# Altium project PCB_Project_Main.PrjPcb
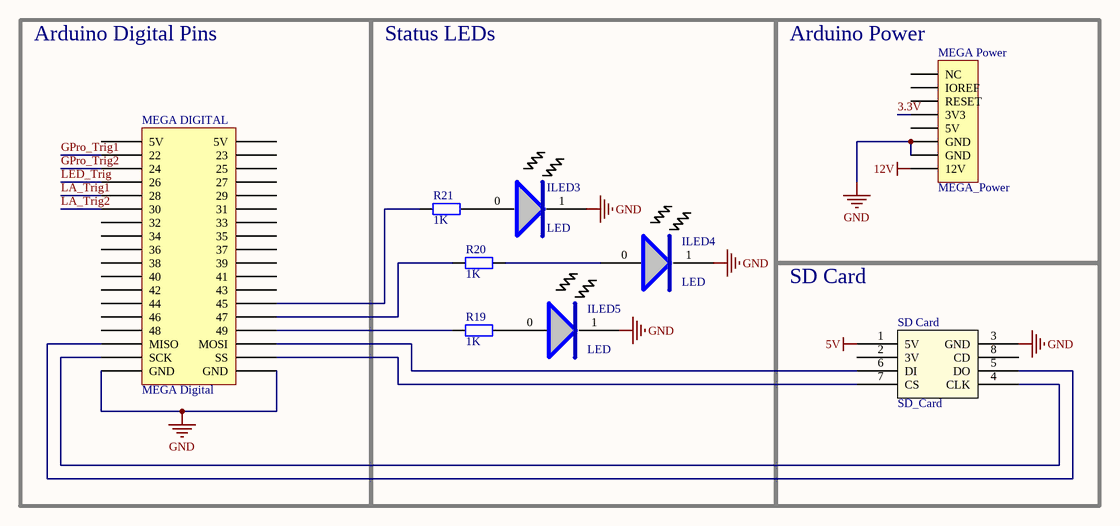
[diagram p0: ArduinoPWR-DIG_SDCard.SchDoc]
6 sheets, 107 parts. Net scope: global (net labels, ports and power ports of the same name join across sheets).
Board files: ArduinoMainBoard.PcbDoc, mainPCB_V2.PcbDoc
Sheets:
  ArduinoPWR-DIG_SDCard.SchDoc
  Analog_Input.SchDoc
  Telemetry_AnalogSensors_PTC08_Shifter.SchDoc
  Power_TimerEvents.SchDoc
  GoPro_Actuator_LED.SchDoc
  temp_presX3.SchDoc

## Sheet ArduinoPWR-DIG_SDCard.SchDoc
size A

### Parts
ILED3  LED  [LED]
ILED4  LED  [LED]
ILED5  LED  [LED]
MEGA_DIGITAL  MEGA Digital  [HDR2X18]
MEGA_Power  MEGA_Power  [HDR1X8]
R19  value 1K  [AXIAL-0.4]  (hidden comment: Res2)
R20  value 1K  [AXIAL-0.4]  (hidden comment: Res2)
R21  value 1K  [AXIAL-0.4]  (hidden comment: Res2)
SD_Card  SD_Card  [HDR1X8]

### Blocks framed on the sheet
Arduino Digital Pins: MEGA_DIGITAL
Status LEDs: ILED3-ILED5 R19-R21
Arduino Power: MEGA_Power
SD Card: SD_Card

### Nets
5V: SD_Card.1(5V)
12V: MEGA_Power.8(12V)
GND: ILED3.1 ILED4.1 ILED5.1 MEGA_DIGITAL.35(GND) MEGA_DIGITAL.36(GND) MEGA_Power.6(GND) MEGA_Power.7(GND) SD_Card.3(GND)
3.3V: MEGA_Power.4(3V3)
GPro_Trig1: MEGA_DIGITAL.5(22)
GPro_Trig2: MEGA_DIGITAL.25(24)
LA_Trig1: MEGA_DIGITAL.9(28)
LA_Trig2: MEGA_DIGITAL.11(30)
LED_Trig: MEGA_DIGITAL.7(26)
NetILED3_0: ILED3.0 R21.1
NetILED4_0: ILED4.0 R20.1
NetILED5_0: ILED5.0 R19.1
NetMEGA_DIGITAL_26: MEGA_DIGITAL.26(45) R21.2
NetMEGA_DIGITAL_28: MEGA_DIGITAL.28(47) R20.2
NetMEGA_DIGITAL_30: MEGA_DIGITAL.30(49) R19.2
NetMEGA_DIGITAL_31: MEGA_DIGITAL.31(MISO) SD_Card.5(DO)
NetMEGA_DIGITAL_32: MEGA_DIGITAL.32(MOSI) SD_Card.6(DI)
NetMEGA_DIGITAL_33: MEGA_DIGITAL.33(SCK) SD_Card.4(CLK)
NetMEGA_DIGITAL_34: MEGA_DIGITAL.34(SS) SD_Card.7(CS)

Not connected (* = marked no-connect by the designer): MEGA_DIGITAL 1(5V) 2(5V) 3(44) 4(23) 6(25) 8(27) 10(29) 12(31) 13(32) 14(33) 15(34) 16(35) 17(36) 18(37) 19(38) 20(39) 21(40) 22(41) 23(42) 24(43) 27(46) 29(48); MEGA_Power 1(NC) 2(IOREF) 3(RESET) 5(5V); SD_Card 2(3V) 8(CD)

### Notes on the sheet
- Title
- Size:
- Date:
- A
- Number:
- Time:
- Revision:
- Sheet
- of
- File:

### Library data of the parts
MEGA_DIGITAL SD_Card = Component_1
MEGA_Power = Header 8: Header, 8-Pin; LatestRevisionDate: 17-Jul-2002; LatestRevisionNote: Re-released for DXP Platform.; Publisher: Altium Limited
R19-R21 = Res2: Resistor; Published: 8-Jun-2000; LatestRevisionDate: 17-Jul-2002; LatestRevisionNote: Re-released for DXP Platform.; PackageReference: AXIAL-0.4; Publisher: Altium Limited; PackageDescription: Axial Device, Thru-Hole; 2 Leads; 0.4 in Pin Spacing

## Sheet Analog_Input.SchDoc
size A
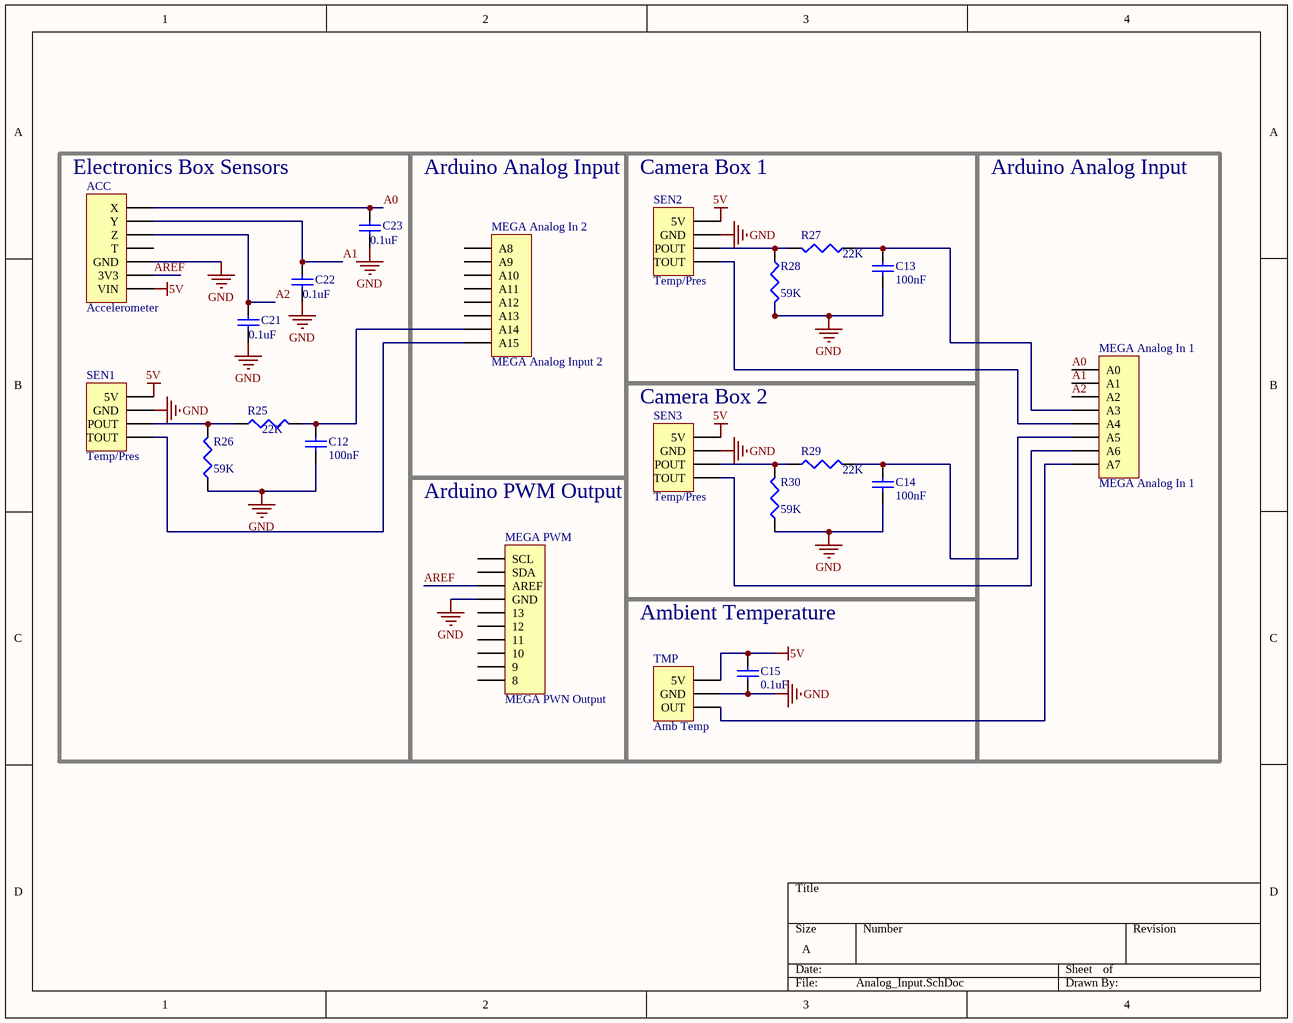
[diagram p1: Analog_Input.SchDoc]

### Parts
ACC  Accelerometer  [HDR1X7]
C12  100nF  [C1206]
C13  100nF  [C1206]
C14  100nF  [C1206]
C15  0.1uF  [C1206]
C21  0.1uF  [C1206]
C22  0.1uF  [C1206]
C23  0.1uF  [C1206]
MEGA_Analog_In_1  MEGA Analog In 1  [HDR1X8]
MEGA_Analog_In_2  MEGA Analog Input 2  [HDR1X8]
MEGA_PWM  MEGA PWN Output  [HDR1X10]
R25  22K  [J1-0603]
R26  59K  [J1-0603]
R27  22K  [J1-0603]
R28  59K  [J1-0603]
R29  22K  [J1-0603]
R30  59K  [J1-0603]
SEN1  Temp/Pres  [HDR1X4]
SEN2  Temp/Pres  [HDR1X4]
SEN3  Temp/Pres  [HDR1X4]
TMP  Amb Temp  [HDR1X3]

### Blocks framed on the sheet
Electronics Box Sensors: ACC C12 C21-C23 R25 R26 SEN1
Arduino Analog Input: MEGA_Analog_In_2
Camera Box 1: C13 R27 R28 SEN2
Arduino Analog Input: MEGA_Analog_In_1
Camera Box 2: C14 R29 R30 SEN3
Arduino PWM Output: MEGA_PWM
Ambient Temperature: C15 TMP

### Nets
5V: ACC.1(VIN) C15.1 SEN1.1(5V) SEN2.1(5V) SEN3.1(5V) TMP.1(5V)
GND: ACC.3(GND) C12.1 C13.1 C14.1 C15.2 C21.1 C22.1 C23.1 MEGA_PWM.4(GND) R26.1 R28.2 R30.1 SEN1.2(GND) SEN2.2(GND) SEN3.2(GND) TMP.2(GND)
A0: ACC.7(X) C23.2 MEGA_Analog_In_1.1(A0)
A1: ACC.6(Y) C22.2 MEGA_Analog_In_1.2(A1)
A2: ACC.5(Z) C21.2 MEGA_Analog_In_1.3(A2)
AREF: ACC.2(3V3) MEGA_PWM.3(AREF)
NetC12_2: C12.2 MEGA_Analog_In_2.7(A14) R25.2
NetC13_2: C13.2 MEGA_Analog_In_1.4(A3) R27.1
NetC14_2: C14.2 MEGA_Analog_In_1.6(A5) R29.2
NetMEGA_Analog_In_1_5: MEGA_Analog_In_1.5(A4) SEN2.4(TOUT)
NetMEGA_Analog_In_1_7: MEGA_Analog_In_1.7(A6) SEN3.4(TOUT)
NetMEGA_Analog_In_1_8: MEGA_Analog_In_1.8(A7) TMP.3(OUT)
NetMEGA_Analog_In_2_8: MEGA_Analog_In_2.8(A15) SEN1.4(TOUT)
NetR25_1: R25.1 R26.2 SEN1.3(POUT)
NetR27_2: R27.2 R28.1 SEN2.3(POUT)
NetR29_1: R29.1 R30.2 SEN3.3(POUT)

Not connected (* = marked no-connect by the designer): ACC 4(T); MEGA_Analog_In_2 1(A8) 2(A9) 3(A10) 4(A11) 5(A12) 6(A13); MEGA_PWM 1(SCL) 2(SDA) 5(13) 6(12) 7(11) 8(10) 9 10(8)

### Library data of the parts
ACC = Header 7: Header, 7-Pin; LatestRevisionDate: 17-Jul-2002; LatestRevisionNote: Re-released for DXP Platform.; Publisher: Altium Limited
C12-C15 C21-C23 = Cap Semi: Capacitor (Semiconductor SIM Model); Published: 8-Jun-2000; LatestRevisionDate: 29-May-2009; LatestRevisionNote: IPC-7351 Footprint Added.; PackageReference: C1206; Publisher: Altium Limited; PackageDescription: Chip Capacitor
  C12-C14: Value: 100nF
  C15 C21-C23: Value: 0.1uF
MEGA_Analog_In_1 MEGA_Analog_In_2 = Header 8: Header, 8-Pin; LatestRevisionDate: 17-Jul-2002; LatestRevisionNote: Re-released for DXP Platform.; Publisher: Altium Limited
MEGA_PWM = Header 10: Header, 10-Pin; LatestRevisionDate: 17-Jul-2002; LatestRevisionNote: Re-released for DXP Platform.; Publisher: Altium Limited
R25-R30 = Res3: Resistor; Published: 8-Jun-2000; LatestRevisionDate: 29-May-2009; LatestRevisionNote: IPC-7351 Footprint Added.; PackageReference: J1-0603; Publisher: Altium Limited; PackageDescription: Chip Resistor
  R25 R27 R29: Value: 22K
  R26 R28 R30: Value: 59K
SEN1-SEN3 = Header 4: Header, 4-Pin; LatestRevisionDate: 17-Jul-2002; LatestRevisionNote: Re-released for DXP Platform.; Publisher: Altium Limited
TMP = Header 3: Header, 3-Pin; LatestRevisionDate: 17-Jul-2002; LatestRevisionNote: Re-released for DXP Platform.; Publisher: Altium Limited

## Sheet Telemetry_AnalogSensors_PTC08_Shifter.SchDoc
size A
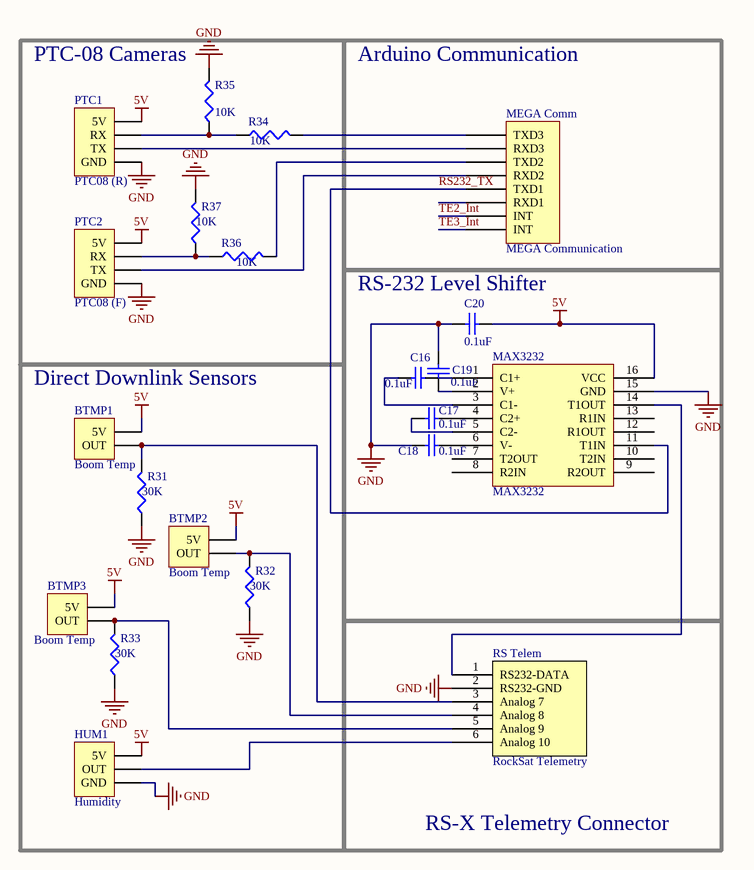
[diagram p2: Telemetry_AnalogSensors_PTC08_Shifter.SchDoc]

### Parts
BTMP1  Boom Temp  [HDR1X2]
BTMP2  Boom Temp  [HDR1X2]
BTMP3  Boom Temp  [HDR1X2]
C16  0.1uF  [C1206]
C17  0.1uF  [C1206]
C18  0.1uF  [C1206]
C19  0.1uF  [C1206]
C20  0.1uF  [C1206]
HUM1  Humidity  [HDR1X3]
MAX3232  MAX3232  [rs232]
MEGA_Comm  MEGA Communication  [HDR1X8]
PTC1  PTC08 (R)  [HDR1X4]
PTC2  PTC08 (F)  [HDR1X4]
R31  30K  [J1-0603]
R32  30K  [J1-0603]
R33  30K  [J1-0603]
R34  10K  [J1-0603]
R35  10K  [J1-0603]
R36  10K  [J1-0603]
R37  10K  [J1-0603]
RS_Telem  RockSat Telemetry  [HDR1X6]

### Blocks framed on the sheet
PTC-08 Cameras: PTC1 PTC2 R34-R37
Arduino Communication: MEGA_Comm
RS-232 Level Shifter: C16-C20 MAX3232
Direct Downlink Sensors: BTMP1-BTMP3 HUM1 R31-R33
RS-X Telemetry Connector: RS_Telem

### Nets
5V: BTMP1.1(5V) BTMP2.1(5V) BTMP3.1(5V) C20.1 HUM1.3(5V) MAX3232.16(VCC) PTC1.1(5V) PTC2.1(5V)
GND: C18.1 C19.2 C20.2 HUM1.1(GND) MAX3232.15(GND) PTC1.4(GND) PTC2.4(GND) R31.1 R32.1 R33.1 R35.2 R37.2 RS_Telem.2(RS232-GND)
RS232_TX: MAX3232.11(T1IN) MEGA_Comm.5(TXD1)
TE2_Int: MEGA_Comm.7(INT)
TE3_Int: MEGA_Comm.8(INT)
NetBTMP1_2: BTMP1.2(OUT) R31.2 RS_Telem.3(Analog_7)
NetBTMP2_2: BTMP2.2(OUT) R32.2 RS_Telem.4(Analog_8)
NetBTMP3_2: BTMP3.2(OUT) R33.2 RS_Telem.5(Analog_9)
NetC16_1: C16.1 MAX3232.1(C1+)
NetC16_2: C16.2 MAX3232.3(C1-)
NetC17_1: C17.1 MAX3232.4(C2+)
NetC17_2: C17.2 MAX3232.5(C2-)
NetC18_2: C18.2 MAX3232.6(V-)
NetC19_1: C19.1 MAX3232.2(V+)
NetHUM1_2: HUM1.2(OUT) RS_Telem.6(Analog_10)
NetMAX3232_14: MAX3232.14(T1OUT) RS_Telem.1(RS232-DATA)
NetMEGA_Comm_1: MEGA_Comm.1(TXD3) R34.2
NetMEGA_Comm_2: MEGA_Comm.2(RXD3) PTC1.3(TX)
NetMEGA_Comm_3: MEGA_Comm.3(TXD2) R36.2
NetMEGA_Comm_4: MEGA_Comm.4(RXD2) PTC2.3(TX)
NetPTC1_2: PTC1.2(RX) R34.1 R35.1
NetPTC2_2: PTC2.2(RX) R36.1 R37.1

Not connected (* = marked no-connect by the designer): MAX3232 7(T2OUT) 8(R2IN) 9(R2OUT) 10(T2IN) 12(R1OUT) 13(R1IN); MEGA_Comm 6(RXD1)

### Library data of the parts
BTMP1-BTMP3 = Header 2: Header, 2-Pin; LatestRevisionDate: 17-Jul-2002; LatestRevisionNote: Re-released for DXP Platform.; Publisher: Altium Limited
C16-C20 = Cap Semi: Capacitor (Semiconductor SIM Model); Published: 8-Jun-2000; LatestRevisionDate: 29-May-2009; LatestRevisionNote: IPC-7351 Footprint Added.; PackageReference: C1206; Publisher: Altium Limited; PackageDescription: Chip Capacitor; Value: 0.1uF
HUM1 = Header 3: Header, 3-Pin; LatestRevisionDate: 17-Jul-2002; LatestRevisionNote: Re-released for DXP Platform.; Publisher: Altium Limited
MEGA_Comm RS_Telem = Component_1
PTC1 PTC2 = Header 4: Header, 4-Pin; LatestRevisionDate: 17-Jul-2002; LatestRevisionNote: Re-released for DXP Platform.; Publisher: Altium Limited
R31-R37 = Res3: Resistor; Published: 8-Jun-2000; LatestRevisionDate: 29-May-2009; LatestRevisionNote: IPC-7351 Footprint Added.; PackageReference: J1-0603; Publisher: Altium Limited; PackageDescription: Chip Resistor
  R31-R33: Value: 30K
  R34-R37: Value: 10K

## Sheet Power_TimerEvents.SchDoc
size A
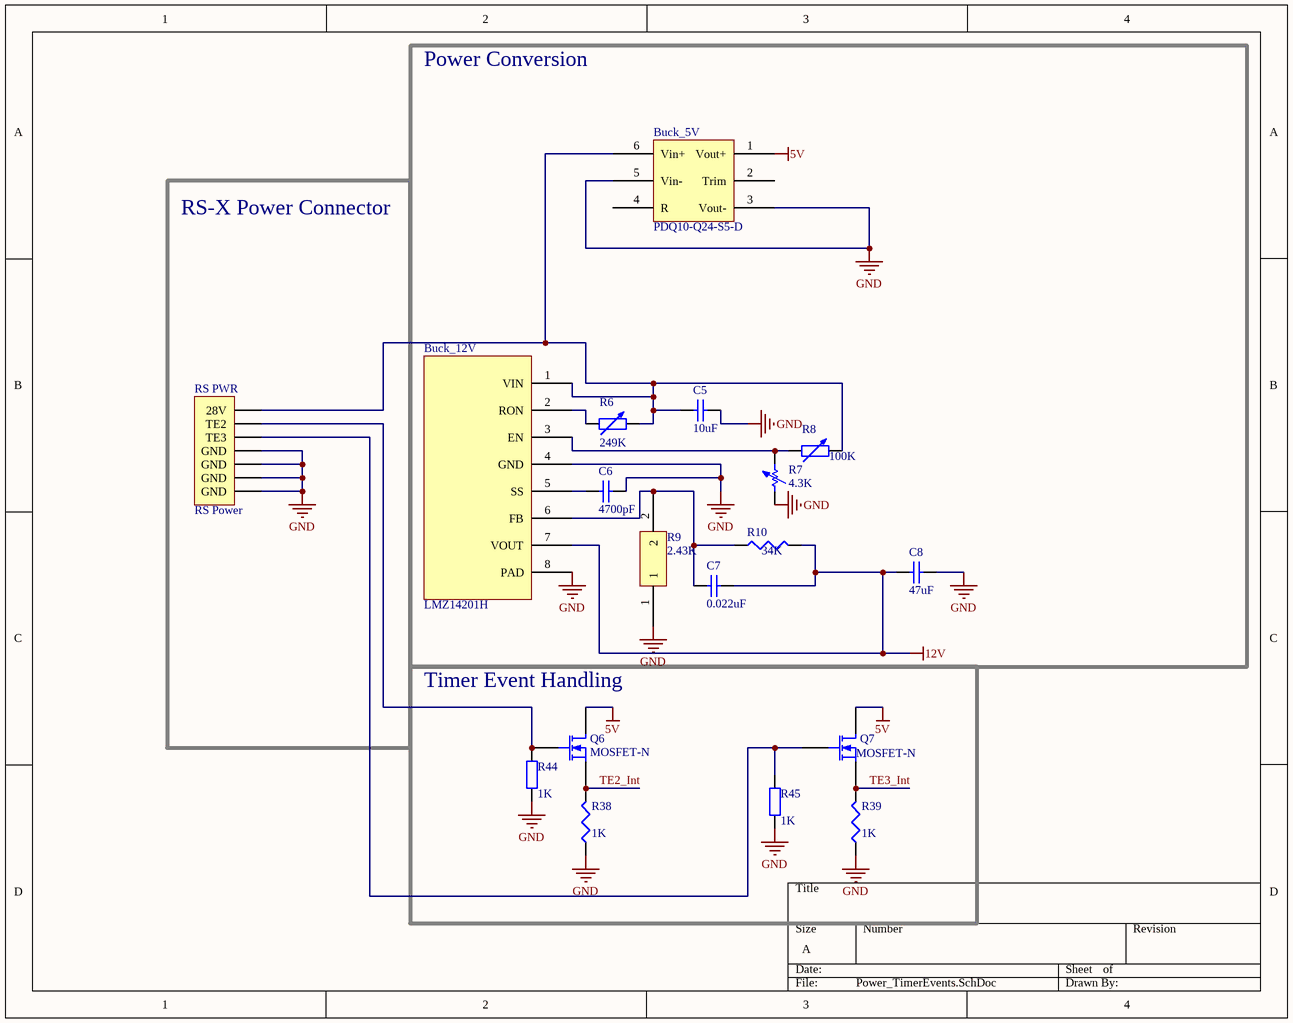
[diagram p3: Power_TimerEvents.SchDoc]

### Parts
Buck_5V  PDQ10-Q24-S5-D  [buck_5V]
Buck_12V  LMZ14201H  [LMZ1420]
C5  10uF  [C1206]
C6  4700pF  [1608[0603]]
C7  0.022uF  [1608[0603]]
C8  47uF  [C1206]
Q6  MOSFET-N  [E3]
Q7  MOSFET-N  [E3]
R6  249K  [AXIAL-0.6]
R7  4.3K  [AXIAL-0.7]
R8  100K  [AXIAL-0.6]
R9  2.43K  [smd_R9]
R10  34K  [12Z-2010]
R38  1K  [J1-0603]
R39  1K  [J1-0603]
R44  1K  [AXIAL-0.4]
R45  1K  [AXIAL-0.4]
RS_PWR  RS Power  [HDR1X7]

### Blocks framed on the sheet
Power Conversion: Buck_5V Buck_12V C5-C8 R6-R10
RS-X Power Connector: RS_PWR
Timer Event Handling: Q6 Q7 R38 R39 R44 R45

### Nets
5V: Buck_5V.1(Vout+) Q6.1(D) Q7.1(D)
12V: Buck_12V.7(VOUT) C7.2 C8.1 R10.2
GND: Buck_5V.3(Vout-) Buck_5V.5(Vin-) Buck_12V.4(GND) Buck_12V.8(PAD) C5.2 C6.2 C8.2 R7.1 R9.1 R38.1 R39.1 R44.1 R45.1 RS_PWR.4(GND) RS_PWR.5(GND) RS_PWR.6(GND) RS_PWR.7(GND)
TE2_Int: Q6.3(S) R38.2
TE3_Int: Q7.3(S) R39.2
NetBuck_5V_6: Buck_5V.6(Vin+) Buck_12V.1(VIN) C5.1 R6.2 R8.2 RS_PWR.1(28V)
NetBuck_12V_2: Buck_12V.2(RON) R6.1
NetBuck_12V_3: Buck_12V.3(EN) R7.2 R8.1
NetBuck_12V_5: Buck_12V.5(SS) C6.1
NetBuck_12V_6: Buck_12V.6(FB) C7.1 R9.2 R10.1
NetQ6_2: Q6.2(G) R44.2 RS_PWR.2(TE2)
NetQ7_2: Q7.2(G) R45.2 RS_PWR.3(TE3)

Not connected (* = marked no-connect by the designer): Buck_5V 2(Trim) 4(R)

### Library data of the parts
Buck_5V = buck_5V
Buck_12V = Component_1
C5-C8 = Cap Semi: Capacitor (Semiconductor SIM Model); Published: 8-Jun-2000; LatestRevisionDate: 29-May-2009; LatestRevisionNote: IPC-7351 Footprint Added.; PackageReference: C1206; Publisher: Altium Limited; PackageDescription: Chip Capacitor
  C5: Value: 10uF
  C6: Value: 4700pF
  C7: Value: 0.022uF
  C8: Value: 47uF
Q6 Q7 = MOSFET-N: N-Channel MOSFET; Published: 8-Jun-2000; LatestRevisionDate: 17-Jul-2002; LatestRevisionNote: Re-released for DXP Platform.; PackageVersion: 1995/1996; PackageReference: E3; Publisher: Altium Limited; PackageDescription: TO, Flat Index; 3 In-Line, Axial Leads; Body Dia. 4.6mm; Lead Dia. 0.5 mm (max)
R6 R8 = Res Adj2: Variable Resistor; Set Position: 0.5; Published: 8-Jun-2000; LatestRevisionDate: 17-Jul-2002; LatestRevisionNote: Re-released for DXP Platform.; PackageReference: AXIAL-0.6; Publisher: Altium Limited; PackageDescription: Axial Device, Thru-Hole; 2 Leads; 0.6 in Pin Spacing
  R6: Value: 249K
  R8: Value: 100K
R7 = Res Adj1: Variable Resistor; Set Position: 0.5; Published: 8-Jun-2000; LatestRevisionDate: 17-Jul-2002; LatestRevisionNote: Re-released for DXP Platform.; PackageReference: AXIAL-0.7; Publisher: Altium Limited; PackageDescription: Axial Device, Thru-Hole; 2 Leads; 0.7 in Pin Spacing; Value: 4.3K
R9 = smd_R9
R10 R38 R39 = Res3: Resistor; Published: 8-Jun-2000; LatestRevisionDate: 29-May-2009; LatestRevisionNote: IPC-7351 Footprint Added.; PackageReference: J1-0603; Publisher: Altium Limited; PackageDescription: Chip Resistor
  R10: Value: 34K
  R38 R39: Value: 1K
R44 R45 = Res2: Resistor; Published: 8-Jun-2000; LatestRevisionDate: 17-Jul-2002; LatestRevisionNote: Re-released for DXP Platform.; PackageReference: AXIAL-0.4; Publisher: Altium Limited; PackageDescription: Axial Device, Thru-Hole; 2 Leads; 0.4 in Pin Spacing; Value: 1K
RS_PWR = Header 7: Header, 7-Pin; LatestRevisionDate: 17-Jul-2002; LatestRevisionNote: Re-released for DXP Platform.; Publisher: Altium Limited

## Sheet GoPro_Actuator_LED.SchDoc
size A
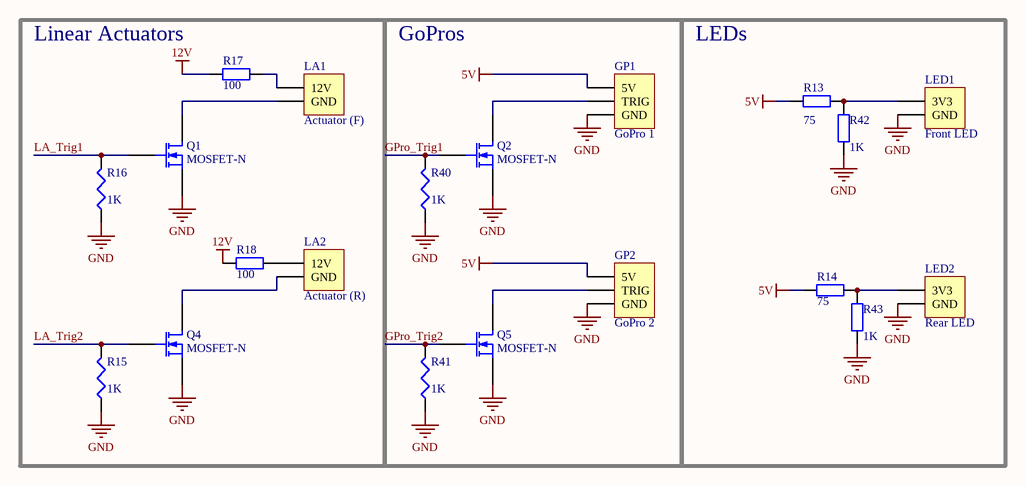
[diagram p4: GoPro_Actuator_LED.SchDoc]

### Parts
GP1  GoPro 1  [HDR1X3]
GP2  GoPro 2  [HDR1X3]
LA1  Actuator (F)  [HDR1X2]
LA2  Actuator (R)  [HDR1X2]
LED1  Front LED  [HDR1X2]
LED2  Rear LED  [HDR1X2]
Q1  MOSFET-N  [E3]
Q2  MOSFET-N  [E3]
Q4  MOSFET-N  [E3]
Q5  MOSFET-N  [E3]
R13  value 75  [AXIAL-0.4]  (hidden comment: Res2)
R14  value 75  [AXIAL-0.4]  (hidden comment: Res2)
R15  1K  [J1-0603]
R16  1K  [J1-0603]
R17  value 100  [AXIAL-0.4]  (hidden comment: Res2)
R18  value 100  [AXIAL-0.4]  (hidden comment: Res2)
R40  1K  [J1-0603]
R41  1K  [J1-0603]
R42  value 1K  [AXIAL-0.4]  (hidden comment: Res2)
R43  value 1K  [AXIAL-0.4]  (hidden comment: Res2)

### Blocks framed on the sheet
Linear Actuators: LA1 LA2 Q1 Q4 R15-R18
GoPros: GP1 GP2 Q2 Q5 R40 R41
LEDs: LED1 LED2 R13 R14 R42 R43

### Nets
5V: GP1.1(5V) GP2.1(5V) R13.2 R14.2
12V: R17.1 R18.1
GND: GP1.3(GND) GP2.3(GND) LED1.2(GND) LED2.2(GND) Q1.3(S) Q2.3(S) Q4.3(S) Q5.3(S) R15.1 R16.1 R40.1 R41.1 R42.1 R43.2
GPro_Trig1: Q2.2(G) R40.2
GPro_Trig2: Q5.2(G) R41.2
LA_Trig1: Q1.2(G) R16.2
LA_Trig2: Q4.2(G) R15.2
NetGP1_2: GP1.2(TRIG) Q2.1(D)
NetGP2_2: GP2.2(TRIG) Q5.1(D)
NetLA1_1: LA1.1(12V) R17.2
NetLA1_2: LA1.2(GND) Q1.1(D)
NetLA2_1: LA2.1(12V) R18.2
NetLA2_2: LA2.2(GND) Q4.1(D)
NetLED1_1: LED1.1(3V3) R13.1 R42.2
NetLED2_1: LED2.1(3V3) R14.1 R43.1

### Library data of the parts
GP1 GP2 = Header 3: Header, 3-Pin; LatestRevisionDate: 17-Jul-2002; LatestRevisionNote: Re-released for DXP Platform.; Publisher: Altium Limited
LA1 LA2 LED1 LED2 = Header 2: Header, 2-Pin; LatestRevisionDate: 17-Jul-2002; LatestRevisionNote: Re-released for DXP Platform.; Publisher: Altium Limited
Q1 Q2 Q4 Q5 = MOSFET-N: N-Channel MOSFET; Published: 8-Jun-2000; LatestRevisionDate: 17-Jul-2002; LatestRevisionNote: Re-released for DXP Platform.; PackageVersion: 1995/1996; PackageReference: E3; Publisher: Altium Limited; PackageDescription: TO, Flat Index; 3 In-Line, Axial Leads; Body Dia. 4.6mm; Lead Dia. 0.5 mm (max)
R13 R14 R17 R18 R42 R43 = Res2: Resistor; Published: 8-Jun-2000; LatestRevisionDate: 17-Jul-2002; LatestRevisionNote: Re-released for DXP Platform.; PackageReference: AXIAL-0.4; Publisher: Altium Limited; PackageDescription: Axial Device, Thru-Hole; 2 Leads; 0.4 in Pin Spacing
R15 R16 R40 R41 = Res3: Resistor; Published: 8-Jun-2000; LatestRevisionDate: 29-May-2009; LatestRevisionNote: IPC-7351 Footprint Added.; PackageReference: J1-0603; Publisher: Altium Limited; PackageDescription: Chip Resistor; Value: 1K

## Sheet temp_presX3.SchDoc
size A
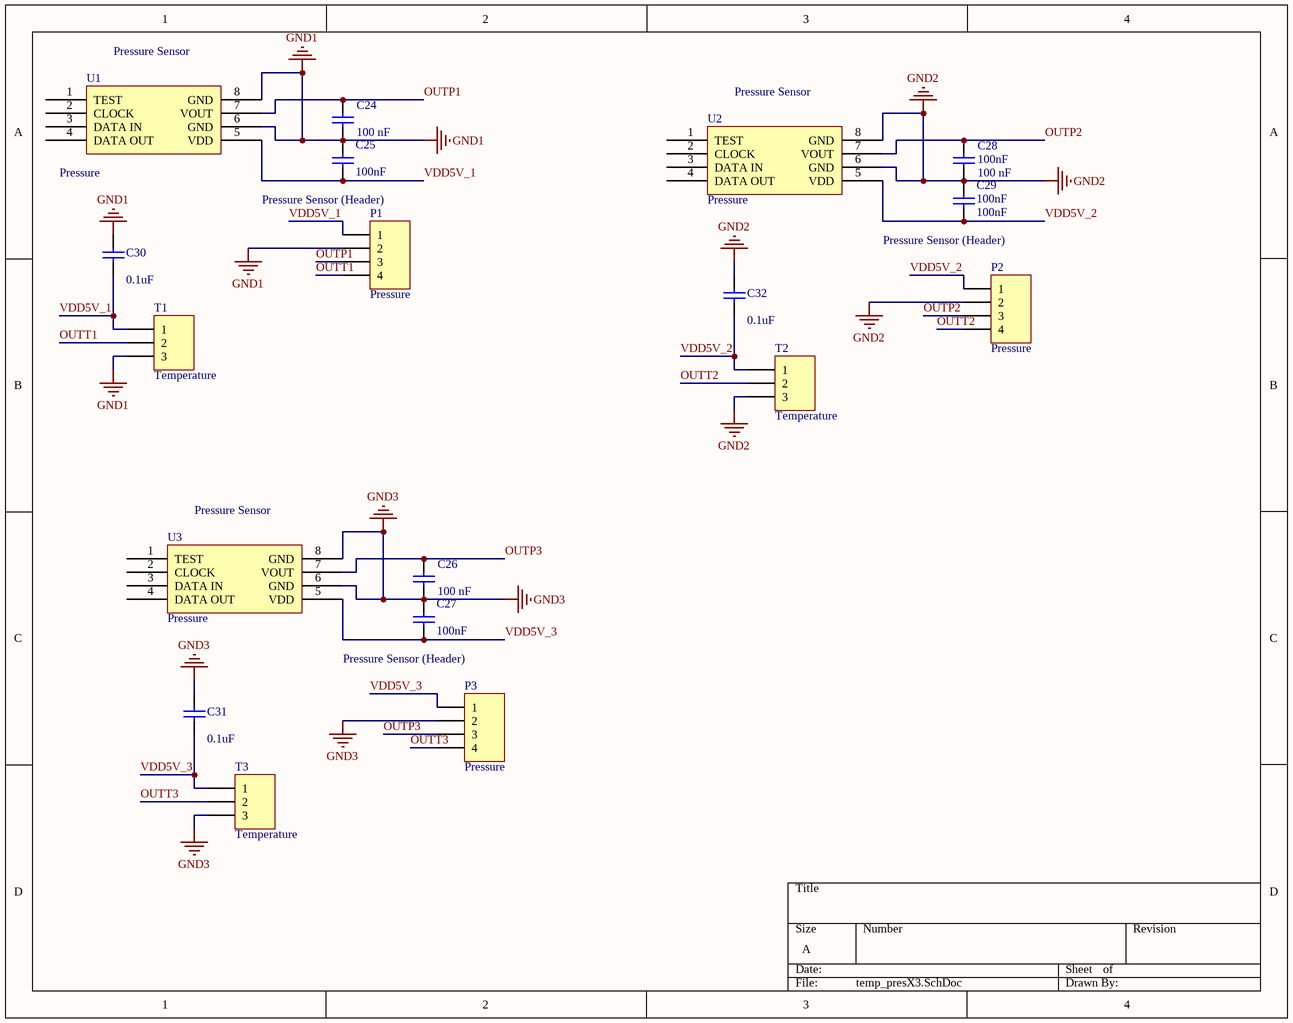
[diagram p5: temp_presX3.SchDoc]

### Parts
C24  value 100 nF  [C1206]  (hidden comment: 100nF)
C25  100nF  [C1206]
C26  value 100 nF  [C1206]  (hidden comment: 100nF)
C27  100nF  [C1206]
C28  100nF  value 100 nF  [C1206]
C29  100nF  [C1206]
C30  0.1uF  [C1206]
C31  0.1uF  [C1206]
C32  0.1uF  [C1206]
P1  Pressure  [HDR1X4]
P2  Pressure  [HDR1X4]
P3  Pressure  [HDR1X4]
T1  Temperature  [HDR1X3]
T2  Temperature  [HDR1X3]
T3  Temperature  [HDR1X3]
U1  Pressure  [KP-234]
U2  Pressure  [KP-234]
U3  Pressure  [KP-234]

### Nets
GND1: C24.1 C25.2 C30.2 P1.2 T1.3 U1.6(GND) U1.8(GND)
GND2: C28.1 C29.2 C32.2 P2.2 T2.3 U2.6(GND) U2.8(GND)
GND3: C26.1 C27.2 C31.2 P3.2 T3.3 U3.6(GND) U3.8(GND)
OUTP1: C24.2 P1.3 U1.7(VOUT)
OUTP2: C28.2 P2.3 U2.7(VOUT)
OUTP3: C26.2 P3.3 U3.7(VOUT)
OUTT1: P1.4 T1.2
OUTT2: P2.4 T2.2
OUTT3: P3.4 T3.2
VDD5V_1: C25.1 C30.1 P1.1 T1.1 U1.5(VDD)
VDD5V_2: C29.1 C32.1 P2.1 T2.1 U2.5(VDD)
VDD5V_3: C27.1 C31.1 P3.1 T3.1 U3.5(VDD)

Not connected (* = marked no-connect by the designer): U1 1(TEST) 2(CLOCK) 3(DATA_IN) 4(DATA_OUT); U2 1(TEST) 2(CLOCK) 3(DATA_IN) 4(DATA_OUT); U3 1(TEST) 2(CLOCK) 3(DATA_IN) 4(DATA_OUT)

### Notes on the sheet
- (near U1) Pressure Sensor
- (near U2) Pressure Sensor
- Pressure Sensor (Header)
- (near U3) Pressure Sensor

### Library data of the parts
C24-C32 = Cap Semi: Capacitor (Semiconductor SIM Model); Published: 8-Jun-2000; LatestRevisionDate: 29-May-2009; LatestRevisionNote: IPC-7351 Footprint Added.; PackageReference: C1206; Publisher: Altium Limited; PackageDescription: Chip Capacitor
  C25 C27 C29: Value: 100nF
  C30-C32: Value: 0.1uF
P1-P3 = Header 4: Header, 4-Pin; LatestRevisionDate: 17-Jul-2002; LatestRevisionNote: Re-released for DXP Platform.; Publisher: Altium Limited
T1-T3 = Header 3: Header, 3-Pin; LatestRevisionDate: 17-Jul-2002; LatestRevisionNote: Re-released for DXP Platform.; Publisher: Altium Limited
U1-U3 = Component_1

## Nets that join several sheets
5V: ArduinoPWR-DIG_SDCard (SD_Card.1), Analog_Input (6 pins), Telemetry_AnalogSensors_PTC08_Shifter (8 pins), Power_TimerEvents (Buck_5V.1 Q6.1 Q7.1), GoPro_Actuator_LED (GP1.1 GP2.1 R13.2 R14.2)
12V: ArduinoPWR-DIG_SDCard (MEGA_Power.8), Power_TimerEvents (Buck_12V.7 C7.2 C8.1 R10.2), GoPro_Actuator_LED (R17.1 R18.1)
GND: ArduinoPWR-DIG_SDCard (8 pins), Analog_Input (16 pins), Telemetry_AnalogSensors_PTC08_Shifter (13 pins), Power_TimerEvents (17 pins), GoPro_Actuator_LED (14 pins)
GPro_Trig1: ArduinoPWR-DIG_SDCard (MEGA_DIGITAL.5), GoPro_Actuator_LED (Q2.2 R40.2)
GPro_Trig2: ArduinoPWR-DIG_SDCard (MEGA_DIGITAL.25), GoPro_Actuator_LED (Q5.2 R41.2)
LA_Trig1: ArduinoPWR-DIG_SDCard (MEGA_DIGITAL.9), GoPro_Actuator_LED (Q1.2 R16.2)
LA_Trig2: ArduinoPWR-DIG_SDCard (MEGA_DIGITAL.11), GoPro_Actuator_LED (Q4.2 R15.2)
TE2_Int: Telemetry_AnalogSensors_PTC08_Shifter (MEGA_Comm.7), Power_TimerEvents (Q6.3 R38.2)
TE3_Int: Telemetry_AnalogSensors_PTC08_Shifter (MEGA_Comm.8), Power_TimerEvents (Q7.3 R39.2)